# EAGLE schematic xbeeDemoRecv (EAGLE 6.4)
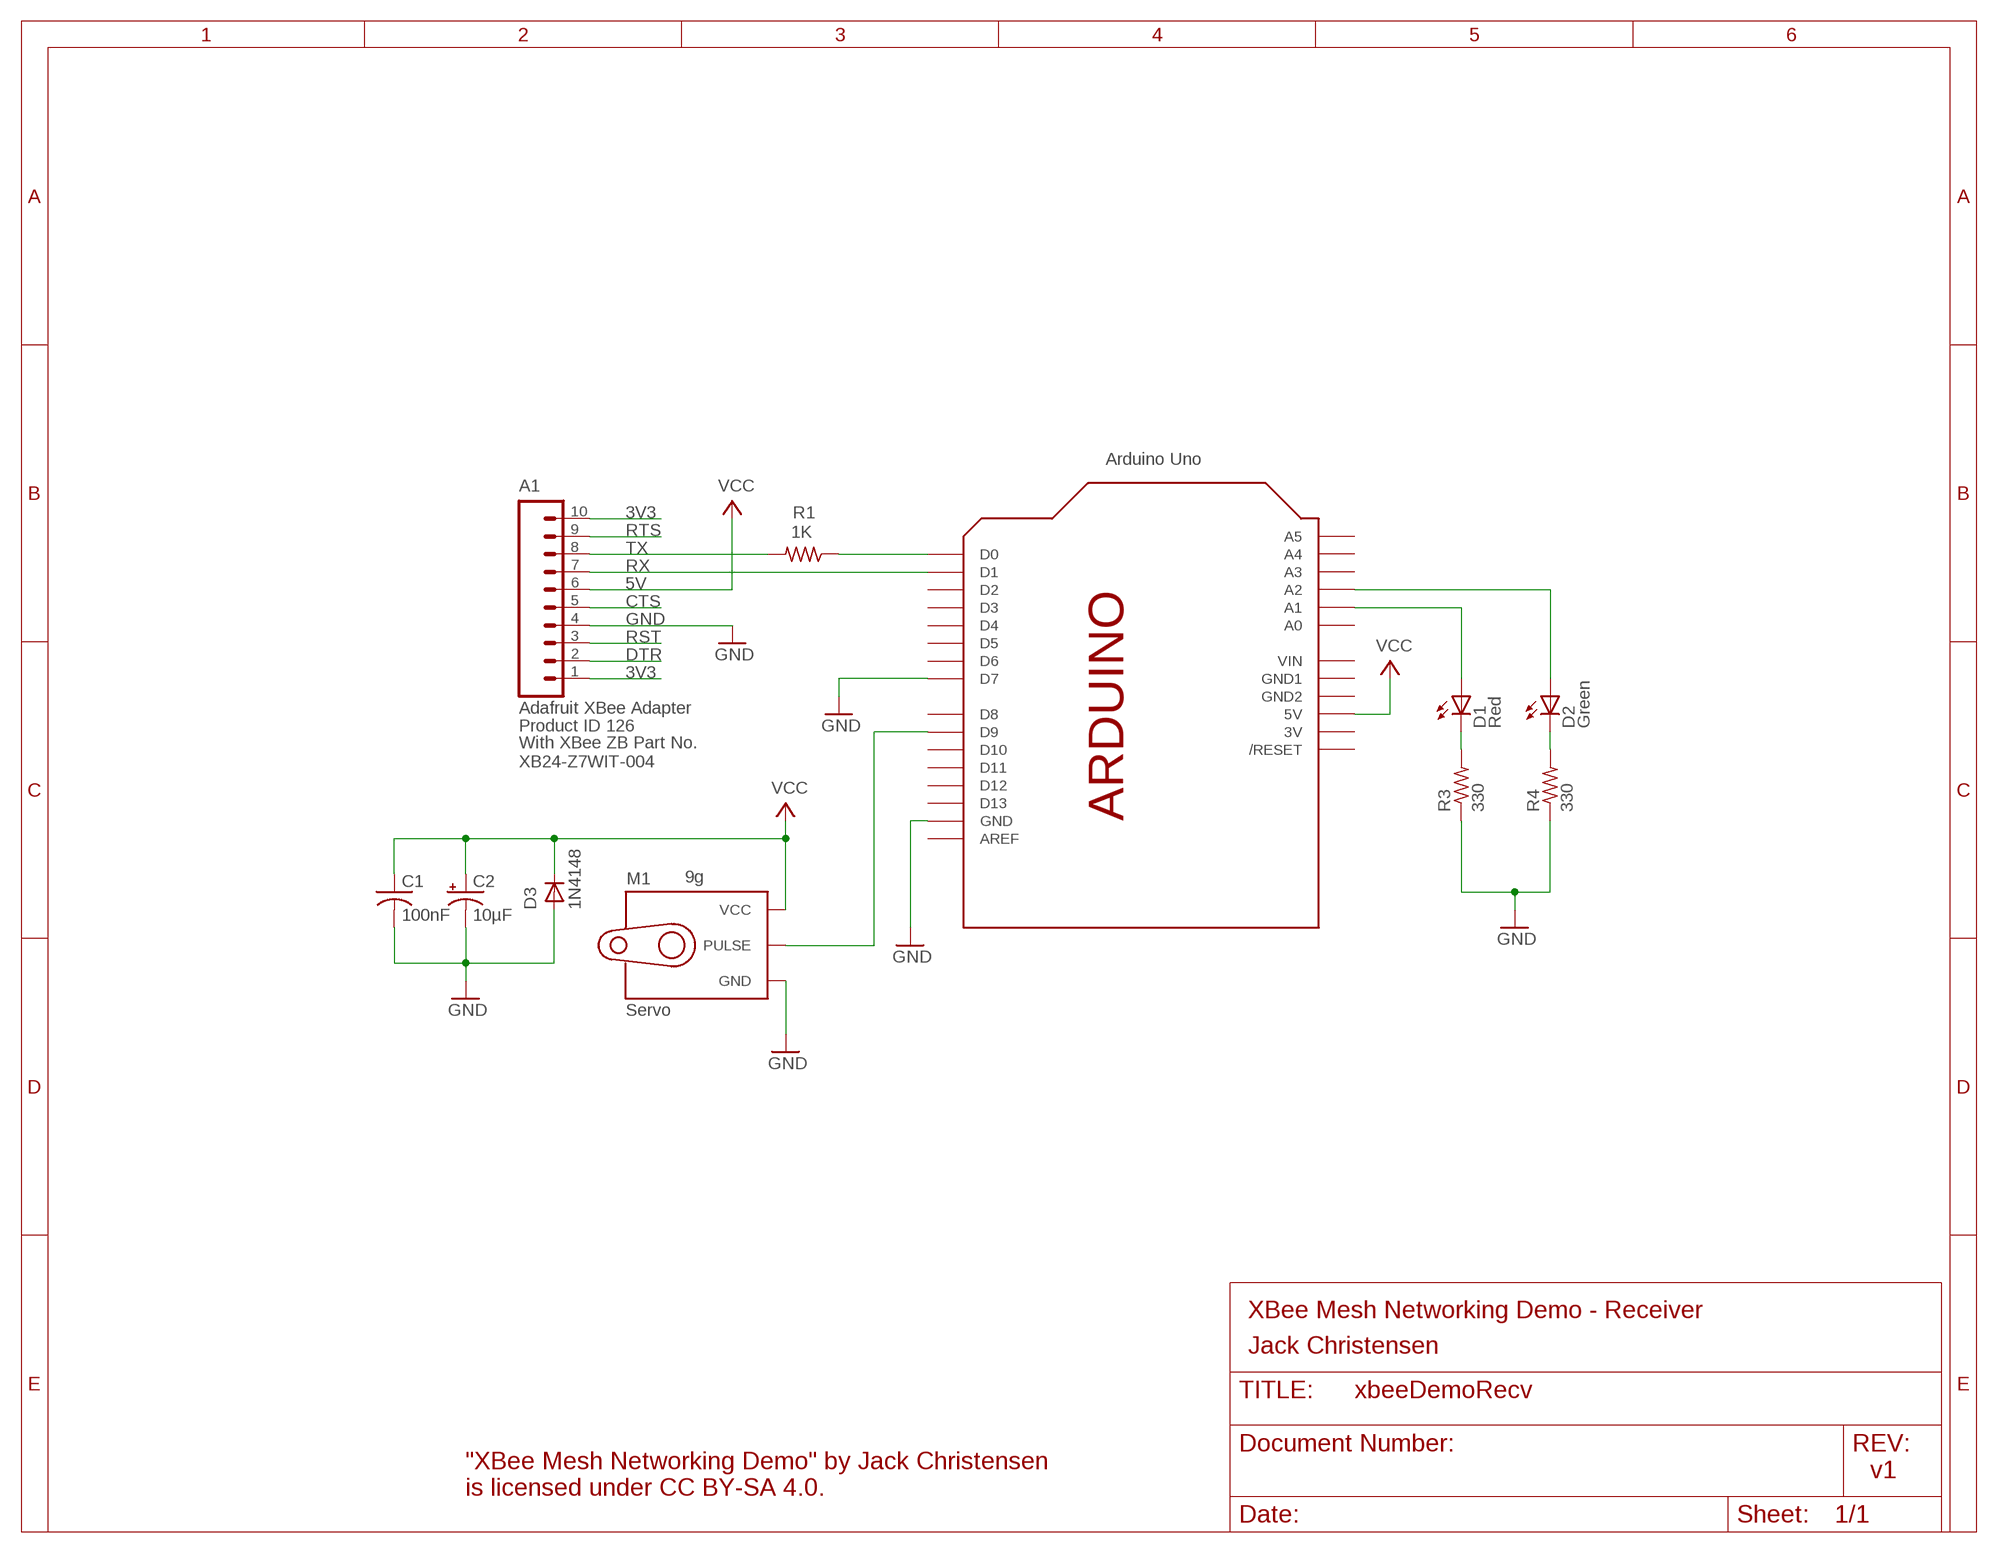
[diagram p0: schematic, sheet 1]

## Parts
A1  Adafruit XBee Adapter  M10LOCK  [1X10_LOCK]
C1  100nF  C-USM0805  [M0805]
C2  10µF  CPOL-USE5-4  [E5-4]
D1  Red  LED5MM  [LED5MM]
D2  Green  LED5MM  [LED5MM]
D3  1N4148  DIODE1N4148  [1N4148]
M1  9g  SERVO  [SERVO]
R1  1K  R-US_M0805  [M0805]
R3  330  R-US_M0805  [M0805]
R4  330  R-US_M0805  [M0805]
U$1  ARDUINOUNO  [ARDUINO]

## Nets
GND: A1.4 C1.2 C2.- D3.A M1.GND R3.1 R4.1 U$1.D7 U$1.GND
N$1: D1.K(C) R3.2
N$2: D2.K(C) R4.2
N$3: D1.A U$1.A1
N$4: A1.10
N$5: D2.A U$1.A2
N$6: A1.9
N$7: A1.8 R1.2
N$8: A1.7 U$1.D1
N$10: R1.1 U$1.D0
N$11: A1.5
N$13: A1.3
N$14: A1.2
N$15: A1.1
N$16: M1.PULSE U$1.D9
VCC: A1.6 C1.1 C2.+ D3.K M1.VCC U$1.5V
Unconnected: U$1.A0 U$1.A3 U$1.A4 U$1.A5 U$1.AREF U$1.D2 U$1.D3 U$1.D4 U$1.D5 U$1.D6 U$1.D8 U$1.D10 U$1.D11 U$1.D12 U$1.D13 U$1.RESET(/RESET)

## Notes on the sheet
- Arduino Uno
- 3V3
- RTS
- TX
- RX
- 5V
- CTS
- GND
- RST
- DTR
- 3V3
- Product ID 126
- With XBee ZB Part No.
  XB24-Z7WIT-004
- Servo
- XBee Mesh Networking Demo - Receiver
- Jack Christensen
- v1
- "XBee Mesh Networking Demo" by Jack Christensen
  is licensed under CC BY-SA 4.0.

## Power pins joined to a net without a drawn wire
3V: U$1.3V
GND1: U$1.GND1
GND2: U$1.GND2
VIN: U$1.VIN

## Library data of the parts
A1 = SparkFun:M10: Header 10 Standard 10-pin 0.1" header. Use with straight break away headers (SKU : PRT-00116), right angle break away headers (PRT-00553), swiss pins (PRT-00743), machine pins (PRT-00117), and female headers (PRT-00115).
C1 = _jc:C-US: CAPACITOR, American symbol
C2 = _jc:CPOL-US: POLARIZED CAPACITOR, American symbol
D1 D2 = _jc:LED: LED OSRAM: - CHIPLED LG R971, LG N971, LY N971, LG Q971, LY Q971, LO R971, LY R971 LH N974, LH R974 LS Q976, LO Q976, LY Q976 LO Q996 - Hyper CHIPLED LW Q18S LB Q993, LB Q99A, LB R99A - SideLED LS A670, LO A670, LY A670, LG A670, LP A670 LB A673, LV A673, LT A673, LW A673 LH A674 LY A675 LS A676, LA A676, LO A676, LY A676, LW A676 LS A679, LY A679, LG A679 - Hyper Micro SIDELED® LS Y876, LA Y876, LO Y876, LY Y876 LT Y87S - SmartLED LW L88C, LW L88S LB L89C, LB L89S, LG L890 LS L89K, LO L89K, LY L89K LS L896, LA L896, LO L896, LY L896 - TOPLED LS T670, LO T670, LY T670, LG T670, LP T670 LSG T670, LSP T670, LSY T670, LOP T670, LYG T670 LG T671, LOG T671, LSG T671 LB T673, LV T673, LT T673, LW T673 LH T674 LS T676, LA T676, LO T676, LY T676, LB T676, LH T676, LSB T676, LW T676 LB T67C, LV T67C, LT T67C, LS T67K, LO T67K, LY T67K, LW E67C LS E67B, LA E67B, LO E67B, LY E67B, LB E67C, LV E67C, LT E67C LW T67C LS T679, LY T679, LG T679 LS T770, LO T770, LY T770, LG T770, LP T770 LB T773, LV T773, LT T773, LW T773 LH T774 LS E675, LA E675, LY E675, LS T675 LS T776, LA T776, LO T776, LY T776, LB T776 LHGB T686 LT T68C, LB T68C - Hyper Mini TOPLED® LB M676 - Mini TOPLED Santana® LG M470 LS M47K, LO M47K, LY M47K Source: http://www.osram.convergy.de/
D3 = _jc:DIODE
M1 = _jc:SERVO
R1 R3 R4 = _jc:R-US_: RESISTOR, American symbol
U$1 = adafruit:ARDUINO: Arduino Diecimila/Duemilanove Make a shield with ease, this package has all the named pins as well as the two mounting drill holes and an outline of the USB and DC power connector. The outline is on the DIMENSION layer, so if your board house uses it they will cut the outline to match. http://www.ladyada.net/library/pcb/eaglelibrary.html